# Altium schematic sheet Sheet_1 copy_2021-11-01.schdoc
size 306 x 210 mm
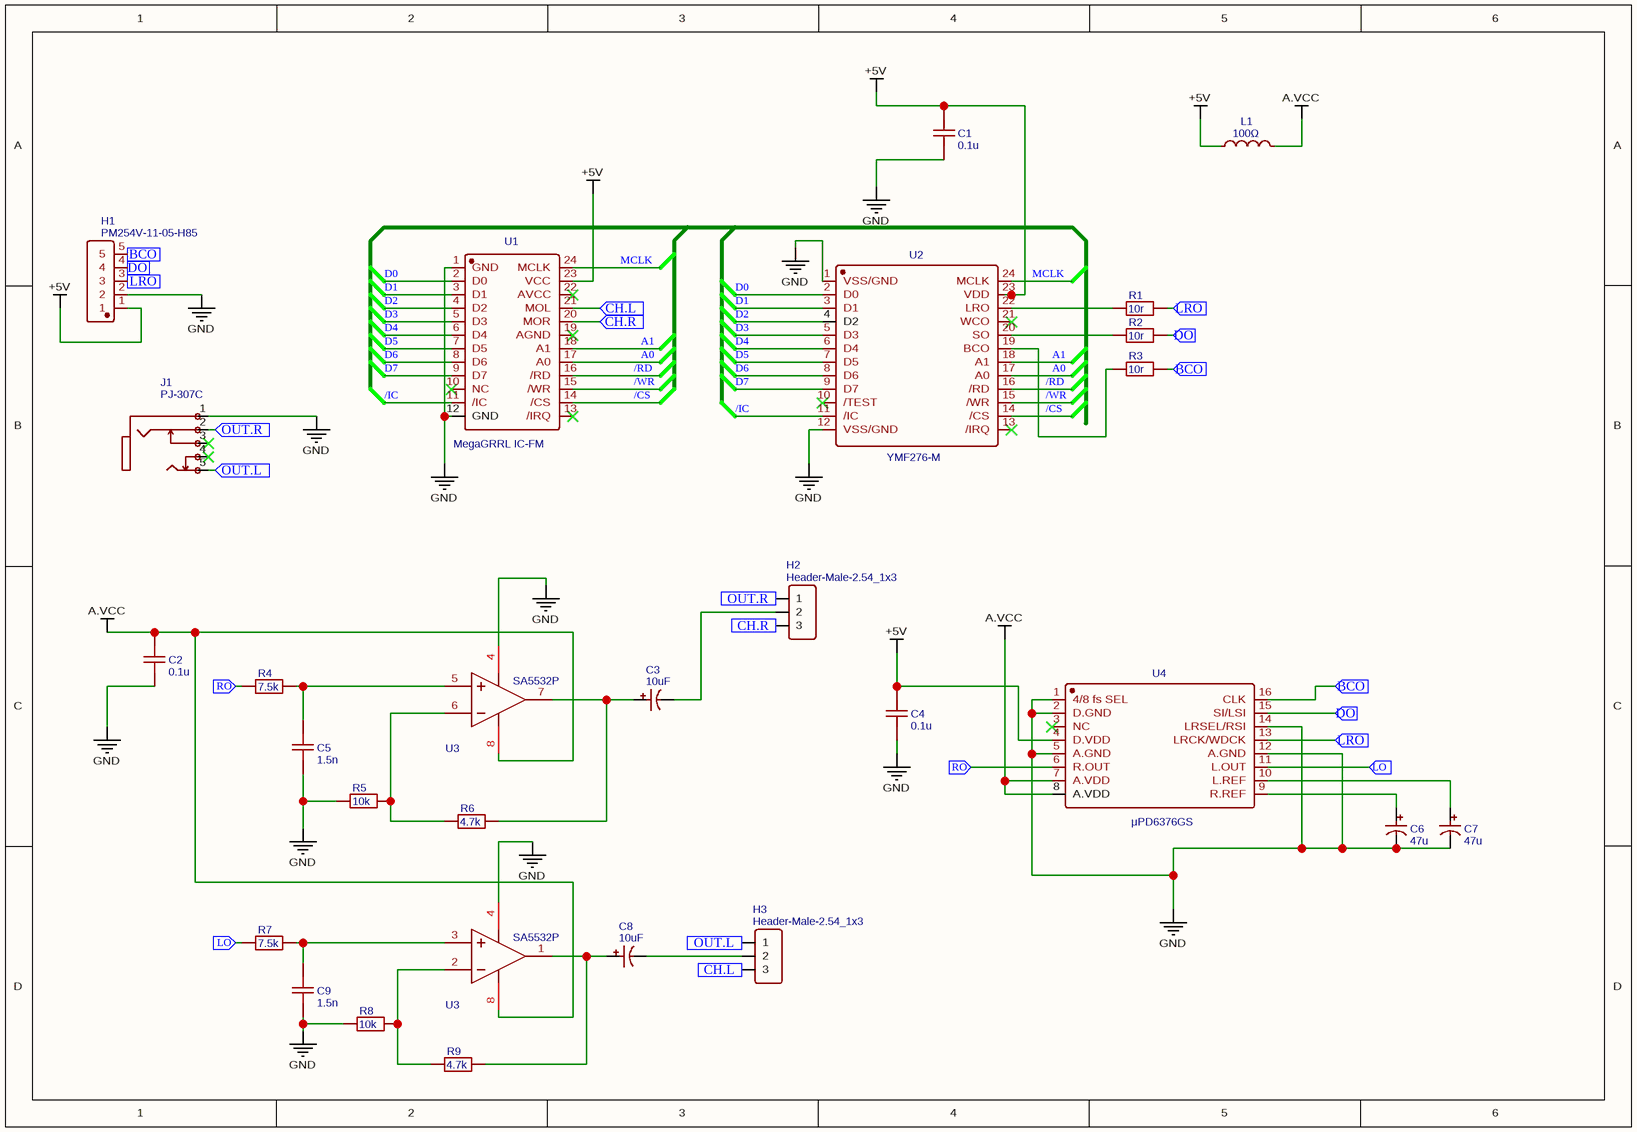
[diagram p0: Sheet_1 copy_2021-11-01.schdoc]

## Parts
(Parts that share a designator on the sheet are numbered #1, #2 ... from top to bottom, then left to right.)
C1  0.1u  [C0603]
C2  0.1u  [C0603]
C3  10uF  [CAP-TH_BD6.3-P2.50-D1.0-FD]
C4  0.1u  [C0603]
C5  1.5n  [C0603]
C6  47u  [CAP-TH_BD6.3-P2.50-D1.0-FD]
C7  47u  [CAP-TH_BD6.3-P2.50-D1.0-FD]
C8  10uF  [CAP-TH_BD6.3-P2.50-D1.0-FD]
C9  1.5n  [C0603]
H1  PM254V-11-05-H85  [HDR-TH_5P-P2.54-V-F]
H2  Header-Male-2.54_1x3  [HDR-TH_3P-P2.54-V-M-1]
H3  Header-Male-2.54_1x3  [HDR-TH_3P-P2.54-V-M-1]
J1  PJ-307C  [AUDIO-TH_PJ307C]
L1  100Ω  [L0603]
R1  10r  [R0603]
R2  10r  [R0603]
R3  10r  [R0603]
R4  7.5k  [R0603]
R5  10k  [R0603]
R6  4.7k  [R0603]
R7  7.5k  [R0603]
R8  10k  [R0603]
R9  4.7k  [R0603]
U1  MegaGRRL IC-FM  [DIP-24_L32.0-W13.8-P2.54-LS15.6-BL]
U2  YMF276-M  [SOIC24-YMF276]
U3#1  SA5532P  [DIP8]
U3#2  SA5532P  [DIP8]
U4  μPD6376GS  [SOIC16-UPD6376]

## Ports
BCO (in), CH.L (in), CH.R (in), DO (in), LO (in), LRO (in), OUT.L (in), OUT.R (in), RO (in)

## Nets
+5V: C1.2 C4.2 H1.1 L1.1 U1.23(VCC) U2.23(VDD) U4.4(D.VDD)
A.VCC: C1.1 C2.1 C2.2 C4.1 C5.2 C6.2 C7.2 C9.2 H1.2 J1.1 L1.2 R5.1 R8.1 U1.1(GND) U1.12(GND) U2.1(VSS/GND) U2.12(VSS/GND) U3#1.4(VCC-) U3#1.8(VCC+) U3#2.4(VCC-) U3#2.8(VCC+) U4.1(4/8_fs_SEL) U4.2(D.GND) U4.5(A.GND) U4.7(A.VDD) U4.8(A.VDD) U4.12(A.GND) U4.14(LRSEL/RSI)  [also labelled GND]
/CS: U1.14(/CS) U2.14(/CS)
/IC: U1.11(/IC) U2.11(/IC)
/RD: U1.16(/RD) U2.16(/RD)
/WR: U1.15(/WR) U2.15(/WR)
A0: U1.17(A0) U2.17(A0)
A1: U1.18(A1) U2.18(A1)
BCO: H1.5 R3.2 U4.16(CLK) ; port BCO
CH.L: H3.3 U1.21(MOL) ; port CH.L
CH.R: H2.3 U1.20(MOR) ; port CH.R
D0: U1.2(D0) U2.2(D0)
D1: U1.3(D1) U2.3(D1)
D2: U1.4(D2) U2.4(D2)
D3: U1.5(D3) U2.5(D3)
D4: U1.6(D4) U2.6(D4)
D5: U1.7(D5) U2.7(D5)
D6: U1.8(D6) U2.8(D6)
D7: U1.9(D7) U2.9(D7)
DO: H1.4 R2.2 U4.15(SI/LSI) ; port DO
LO: R7.1 U4.11(L.OUT) ; port LO
LRO: H1.3 R1.2 U4.13(LRCK/WDCK) ; port LRO
MCLK: U1.24(MCLK) U2.24(MCLK)
OUT.L: H3.1 J1.5 ; port OUT.L
OUT.R: H2.1 J1.2 ; port OUT.R
RO: R4.1 U4.6(R.OUT) ; port RO
NetC3_1: C3.1 R6.2 U3#1.7(OUT2)
NetC3_2: C3.2 H2.2
NetC5_1: C5.1 R4.2 U3#1.5(IN2+)
NetC6_1: C6.1 U4.9(R.REF)
NetC7_1: C7.1 U4.10(L.REF)
NetC8_1: C8.1 R9.2 U3#2.1(OUT1)
NetC8_2: C8.2 H3.2
NetC9_1: C9.1 R7.2 U3#2.3(IN1+)
NetR1_1: R1.1 U2.22(LRO)
NetR2_1: R2.1 U2.20(SO)
NetR3_1: R3.1 U2.19(BCO)
NetR5_2: R5.2 R6.1 U3#1.6(IN2-)
NetR8_2: R8.2 R9.1 U3#2.2(IN1-)

Not connected (* = marked no-connect by the designer): J1 3* 4*; U1 10(NC)* 13(/IRQ)* 19(AGND)* 22(AVCC)*; U2 10(/TEST)* 13(/IRQ)* 21(WCO)*; U4 3(NC)*

## Library data of the parts
C1 C2 C4 = 0.1u: nameAlias: Value(F); Contributor: LCEDA_Lib; spicePre: C; spiceSymbolName: C_0603_US
C3 C8 = 10uF: BOM_Manufacturer: ValuePro; BOM_Manufacturer Part: 电解电容25V 47uF; nameAlias: Capacitance; BOM_Supplier: LCSC; BOM_Supplier Part: C45704; BOM_JLCPCB Part Class: Extended Part; spicePre: C; spiceSymbolName: 25V 47uF
C5 C9 = 1.5n: nameAlias: Value(F); Contributor: LCEDA_Lib; spicePre: C; spiceSymbolName: C_0603_US
C6 C7 = 47u: BOM_Manufacturer: ValuePro; BOM_Manufacturer Part: 电解电容25V 47uF; nameAlias: Capacitance; BOM_Supplier: LCSC; BOM_Supplier Part: C45704; BOM_JLCPCB Part Class: Extended Part; spicePre: C; spiceSymbolName: 25V 47uF
H1 = PM254V-11-05-H85: BOM_Manufacturer: XFCN; Contributor: LCSC; BOM_Supplier: LCSC; BOM_Supplier Part: C541852; BOM_Manufacturer Part: PM254V-11-05-H85; BOM_JLCPCB Part Class: Extended Part; spicePre: H; spiceSymbolName: PM254V-11-05-H85
H2 H3 = Header-Male-2.54_1x3: BOM_Manufacturer: BOOMELE; BOM_Manufacturer Part: Header2.54mm 1*3P; BOM_Supplier: LCSC; BOM_Supplier Part: C49257; BOM_JLCPCB Part Class: Extended Part; spicePre: H; spiceSymbolName: Header-Male-2.54_1x3
J1 = PJ-307C: BOM_Manufacturer: BOOMELE; BOM_Supplier: LCSC; BOM_Manufacturer Part: PJ-307C; BOM_Supplier Part: C16684; BOM_JLCPCB Part Class: Extended Part; spicePre: J; spiceSymbolName: PJ-307C
L1 = 100Ω: BOM_Manufacturer: FH; BOM_Manufacturer Part: CBW160808U102T; nameAlias: Value; BOM_Supplier: LCSC; BOM_Supplier Part: C50069; BOM_JLCPCB Part Class: Extended Part; spicePre: L; spiceSymbolName: CBW160808U102T
R1-R3 = 10r: nameAlias: Value(Ω); Contributor: LCEDA_Lib; spicePre: R; spiceSymbolName: R_0603_EU
R4 R7 = 7.5k: nameAlias: Value(Ω); Contributor: LCEDA_Lib; spicePre: R; spiceSymbolName: R_0603_EU
R5 R8 = 10k: nameAlias: Value(Ω); Contributor: LCEDA_Lib; spicePre: R; spiceSymbolName: R_0603_EU
R6 R9 = 4.7k: nameAlias: Value(Ω); Contributor: LCEDA_Lib; spicePre: R; spiceSymbolName: R_0603_EU
U1 = MegaGRRL IC-FM: BOM_Manufacturer: YAMAHA; BOM_Manufacturer Part: YM2612; Contributor: Denjhang; SMT Type: Extend; BOM_Supplier Part: C707077; BOM_JLCPCB SMD: Yes; spicePre: U; spiceSymbolName: MegaGRRL IC-FM
U2 = YMF276-M: BOM_Manufacturer: YAMAHA; SMT Type: Extend; Contributor: Denjhang; BOM_Manufacturer Part: YMF276-M; BOM_Supplier Part: YMF276-M; BOM_JLCPCB SMD: Yes; spicePre: U; spiceSymbolName: YMF276-M
U3#1 U3#2 = SA5532P: subpart_no: 2; description: Dual Low-Noise Operational Amplifier, 10 to 30 V, -40 to 85 degC, 8-pin DIP (P8), Pb-Free (RoHS); spicePre: U; spiceSymbolName: SA5532P
U4 = μPD6376GS: BOM_Manufacturer: NEC; Voltage - Supply: 2V ~ 5.5V; Contributor: Denjhang; SMT Type: Extend; BOM_Manufacturer Part: μPD6376GS; BOM_Supplier Part: 0; BOM_JLCPCB SMD: Yes; spicePre: U; spiceSymbolName: μPD6376GS